# Altium project FingerBase.PrjPcb
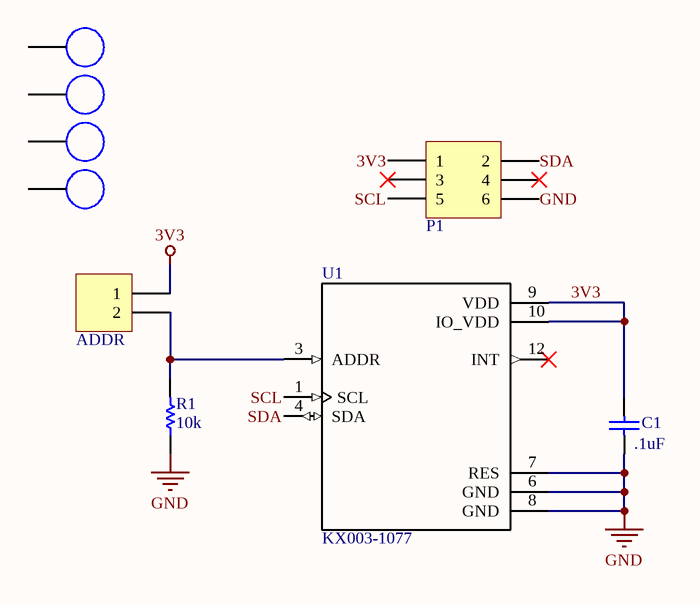
[diagram p0: FingerBase.SchDoc]
1 sheet, 9 parts. Net scope: global (net labels, ports and power ports of the same name join across sheets).
Board file: FingerBase.PcbDoc

## Sheet FingerBase.SchDoc
size A

### Parts
ADDR  90120-0122  [HDR1X2]  (value not drawn)
C1  .1uF  [0805]
DR1  4-40 DRILL HOLE  [4_40 DRILL HOLE]  (value not drawn)  (no BOM)
DR2  4-40 DRILL HOLE  [4_40 DRILL HOLE]  (value not drawn)  (no BOM)
DR3  4-40 DRILL HOLE  [4_40 DRILL HOLE]  (value not drawn)  (no BOM)
DR4  4-40 DRILL HOLE  [4_40 DRILL HOLE]  (value not drawn)  (no BOM)
P1  90131-0123  [HDR2X3]  (value not drawn)
R1  10k  [0805_RES_HD]
U1  KX003-1077  [*XDCR_KX003-1077]

### Nets
3V3: ADDR.1 C1.2 P1.1 U1.9(VDD) U1.10(IO_VDD)
GND: C1.1 P1.6 R1.1 U1.6(GND) U1.7(RES) U1.8(GND)
SCL: P1.5 U1.1(SCL)
SDA: P1.2 U1.4(SDA)
NetADDR_2: ADDR.2 R1.2 U1.3(ADDR)

Not connected (* = marked no-connect by the designer): DR1 0; DR2 0; DR3 0; DR4 0; P1 3* 4*; U1 12(INT)*

### Library data of the parts
ADDR = 90120-0122: MOLEX CONN HEADER 2POS .100" STR TIN; GFUPartNo: 90120-0122; Manufacturer 1: Molex; Manufacturer Part Number 1: 90120-0122; Part Type: THRU; Supplier 1: Digi-Key; Supplier Part Number 1: WM8072-ND
C1 = CL21A475KPFNNNE: .1, 10%, 50V; Manufacturer 1: Samsung; GFUPartNo: CL21A475KPFNNNE; Manufacturer Part Number 1: CL21A475KPFNNNE; Part Type: SMT; PackageReference: 0805; Supplier 1: Digi-Key; Supplier Part Number 1: 1276-1259-1-ND
DR1-DR4 = 4_40 DRILL HOLE: Mounting hole for 4-40 screw, non-BOM; GFUPartNo: 4_40 DRILL HOLE; Manufacturer 1: N/A; Manufacturer Part Number 1: N/A
P1 = 90131-0123: MOLEX CONN HEADER 6POS 2ROW .100" STR TIN; GFUPartNo: 90131-0123; Manufacturer 1: Molex; Manufacturer Part Number 1: 90131-0123; Part Type: THRU; Supplier 1: Digi-Key; Supplier Part Number 1: WM8121-ND
R1 = RC2012F752CS: RES 10K OHM 1/8W 5% 0805; Manufacturer 1: Samsung; GFUPartNo: RC2012F752CS; Manufacturer Part Number 1: RC2012F752CS; Part Type: SMT; Supplier 1: Digi-Key; Supplier Part Number 1: 1276-5324-1-ND
U1 = KX003-1077: / Accelerometer X, Y, Z Axis Â±2g, 4g, 8g, 16g 3.5kHz _X,Y_, 1.8kHz _Z_ 12-LGA _2x2_ /; MF: Rohm Semiconductor; Digi-Key_Part_Number: KX003-1077CT-ND; Package: VFLGA-12 Rohm Semiconductor; SnapEDA_Link: https://www.snapeda.com/parts/KX003-1077/Rohm/view-part/3603894/?ref=snap; Digi-Key_Purchase_URL: https://www.digikey.com/product-detail/en/rohm-semiconductor/KX003-1077/KX003-1077CT-ND/9679234?utm_source=snapeda&utm_medium=aggregator&utm_campaign=symbol; MP: KX003-1077; Value: *